# EAGLE design Mosfet+2Hbridge (EAGLE 9.3.0)
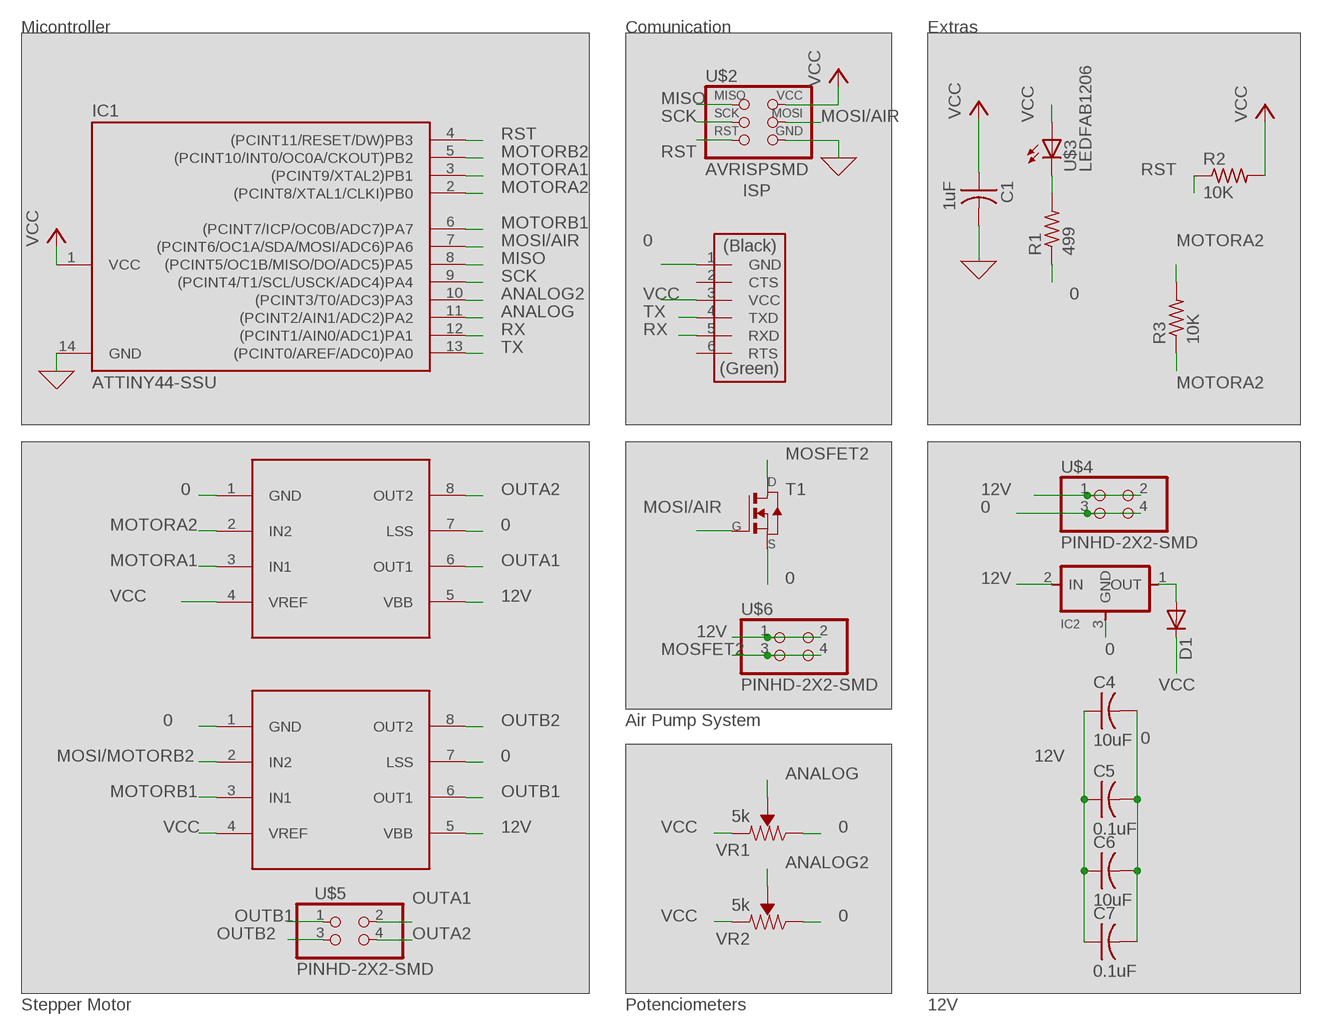
[diagram p0: schematic, sheet 1]

## Parts
C1  1uF  CAP-US1206FAB  [C1206FAB]
C4  10uF  CAP-US1206FAB  [C1206FAB]
C5  0.1uF  CAP-US1206FAB  [C1206FAB]
C6  10uF  CAP-US1206FAB  [C1206FAB]
C7  0.1uF  CAP-US1206FAB  [C1206FAB]
D1  DIODESOD123  [SOD123]
IC1  ATTINY44-SSU  [SOIC14]
IC2  REGULATORSOT23  [SOT23]
R1  499  RES-US1206FAB  [R1206FAB]
R2  10K  RES-US1206FAB  [R1206FAB]
R3  10K  RES-US1206FAB  [R1206FAB]
T1  NMOSFETTO252  [TO252]
U$1  FTDI-SMD-HEADER  [1X06SMD]
U$2  AVRISPSMD  [2X03SMD]
U$3  LEDFAB1206  [LED1206FAB]
U$4  PINHD-2X2-SMD  [2X02SMD]
U$5  PINHD-2X2-SMD  [2X02SMD]
U$6  PINHD-2X2-SMD  [2X02SMD]
U$7  A4953-H-BRIDGE-MOTOR-DRIVER  [SOIC8]
U$8  A4953-H-BRIDGE-MOTOR-DRIVER  [SOIC8]
VR1  5k  TRIMPOT-SMD-5MM-CLOSED-1/4W-20%  [TRIMPOT-SMD-5MM]
VR2  5k  TRIMPOT-SMD-5MM-CLOSED-1/4W-20%  [TRIMPOT-SMD-5MM]

## Nets
0: C1.2 C4.2 C5.2 C6.2 C7.2 IC1.14(GND) IC2.3(GND) R1.1 T1.2(S) U$1.1(GND) U$2.6(GND) U$4.3 U$4.4 U$7.1(GND) U$7.7(LSS) U$8.1(GND) U$8.7(LSS) VR1.C(CW) VR2.C(CW) ; supply symbol labelled GND
12V: C4.1 C5.1 C6.1 C7.1 IC2.2(IN) U$4.1 U$4.2 U$6.1 U$6.2 U$7.5(VBB) U$8.5(VBB)
ANALOG: IC1.11((PCINT2/AIN1/ADC2)PA2) VR1.B(WIPER)
ANALOG2: IC1.10((PCINT3/T0/ADC3)PA3) VR2.B(WIPER)
MISO: IC1.8((PCINT5/OC1B/MISO/DO/ADC5)PA5) U$2.1(MISO)
MOSFET2: T1.3(D) U$6.3 U$6.4
MOSI/AIR: IC1.7((PCINT6/OC1A/SDA/MOSI/ADC6)PA6) T1.1(G) U$2.4(MOSI)
MOSI/MOTORB2: U$7.2(IN2)
MOTORA1: IC1.3((PCINT9/XTAL2)PB1) U$8.3(IN1)
MOTORA2: IC1.2((PCINT8/XTAL1/CLKI)PB0) R3.1 R3.2 U$8.2(IN2)
MOTORB1: IC1.6((PCINT7/ICP/OC0B/ADC7)PA7) U$7.3(IN1)
MOTORB2: IC1.5((PCINT10/INT0/OC0A/CKOUT)PB2)
N$1: R1.2 U$3.2(C)
N$11: D1.ANODE(A) IC2.1(OUT)
OUTA1: U$5.2 U$8.6(OUT1)
OUTA2: U$5.4 U$8.8(OUT2)
OUTB1: U$5.1 U$7.6(OUT1)
OUTB2: U$5.3 U$7.8(OUT2)
RST: IC1.4((PCINT11/RESET/DW)PB3) R2.1 U$2.5(RST)
RX: IC1.12((PCINT1/AIN0/ADC1)PA1) U$1.5(RXD)
SCK: IC1.9((PCINT4/T1/SCL/USCK/ADC4)PA4) U$2.3(SCK)
TX: IC1.13((PCINT0/AREF/ADC0)PA0) U$1.4(TXD)
VCC: C1.1 D1.CATHODE(C) IC1.1(VCC) R2.2 U$1.3(VCC) U$2.2(VCC) U$3.1(A) U$7.4(VREF) U$8.4(VREF) VR1.A(CCW) VR2.A(CCW)
Unconnected: U$1.2(CTS) U$1.6(RTS)

## Notes on the sheet
- Micontroller | Comunication | Extras
- ISP
- Air Pump System
- Stepper Motor | Potenciometers | 12V

## Library data of the parts
C1 C4-C7 = fab:CAP-US
D1 = fab:DIODE: DIODE high speed (Philips)
IC1 = fab:ATTINY44
IC2 = fab:REGULATOR
R1-R3 = fab:RES-US: Resistor (US Symbol) Variants with postfix FAB are widened to allow the routing of internal traces
T1 = fab:NMOSFET: MOS FET
U$1 = fab:FTDI-SMD-HEADER
U$2 = fab:AVRISP
U$3 = fab:LED: LED
U$4-U$6 = fab:PINHD-2X2-SMD
U$7 U$8 = fab:A4953-H-BRIDGE-MOTOR-DRIVER
VR1 VR2 = SparkFun-Resistors:TRIMPOT: Trimming Potentiometer (Trimpot) Three-terminal potentiometers, with an adjustable wiper and two adjustable resistors. A pot can be used to create a configurable voltage divider, or as a variable resistor. "Trimpots" are a subset of potentiometers, usually intended for "set-and-forget" applications. They're often more delicate than standard potentiometers - rated for fewer turns. Variants PTH-KNOB - PTH Trimpot w/ finger-adjustable knob Trimpot 10K with Knob <https://www.sparkfun.com/products/9806> (COM-09806) Datasheet <http://www.sparkfun.com/datasheets/Components/General/TSR-3386.pdf> SMD-3MM-CLOSED-FRAME - SMD 3mm Square Closed-Frame Trimpot Used on e.g. EasyDriver - Stepper Motor Driver <https://www.sparkfun.com/products/12779> Datasheet <http://www.bitechnologies.com/pdfs/22.pdf> (22AR10KTR) SMD-5MM - SMD 5mm Square Closed-Frame Trimpot Used on e.g. IOIO-OTG - V2.2 <https://www.sparkfun.com/products/13613> Datasheet <http://www.vishay.com/docs/51008/ts53.pdf> (TS53YL502MR10) SMD-3MM-1/10W-25% - 3mm Square Open-Frame Trimpot Used on e.g. SparkFun Shapeoko <https://www.sparkfun.com/products/13899> Datasheet <http://www.bourns.com/docs/Product-Datasheets/TC33.pdf> (TC33X-2-103E); PROD_ID: RES-11156

## Board
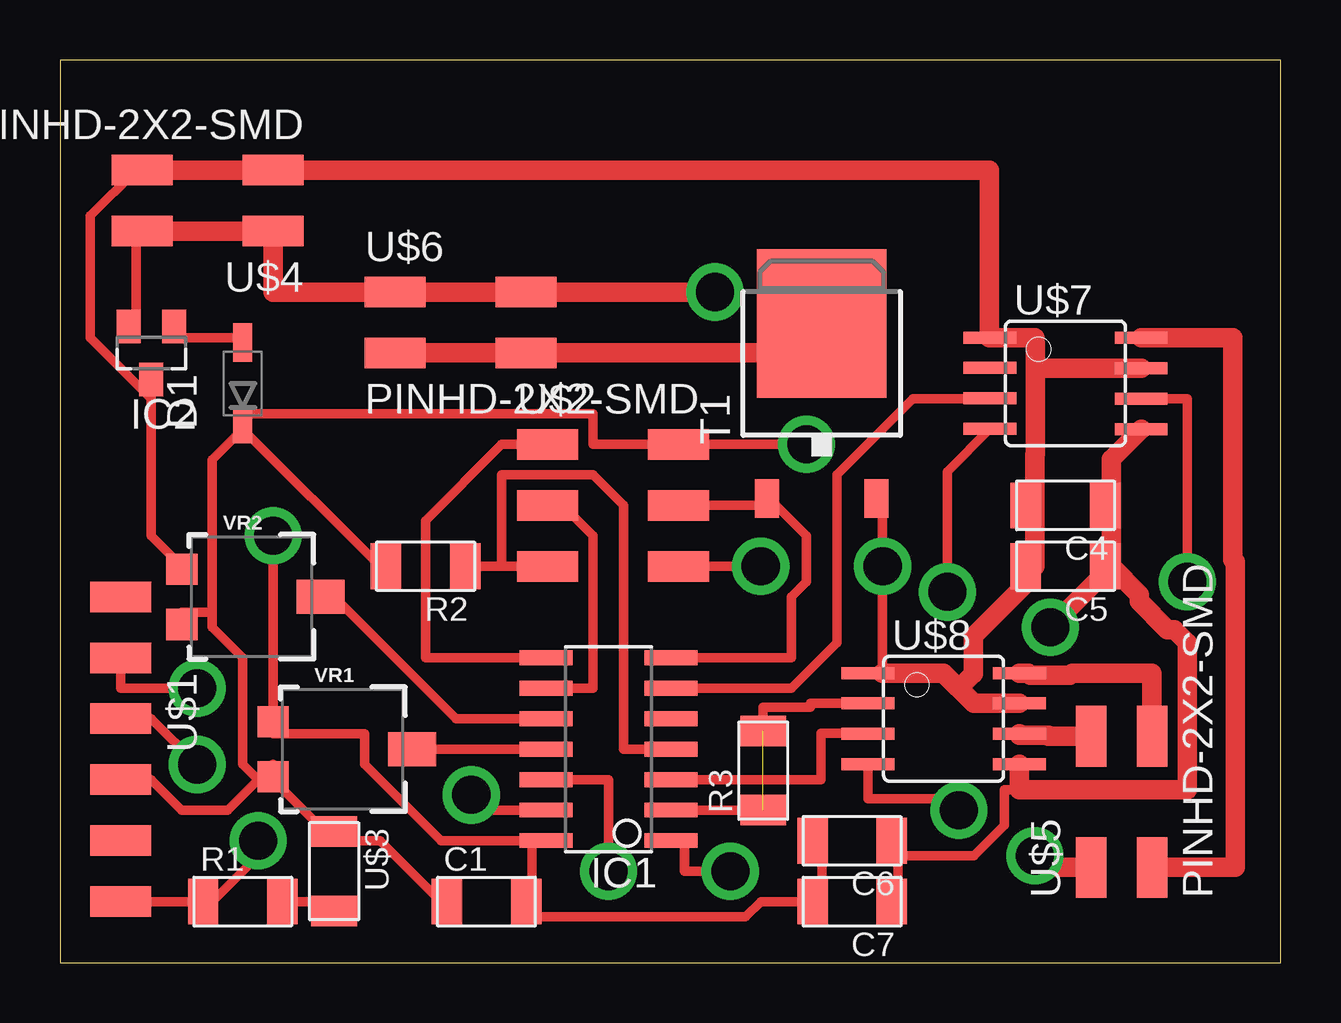
[diagram p1: board, top side]
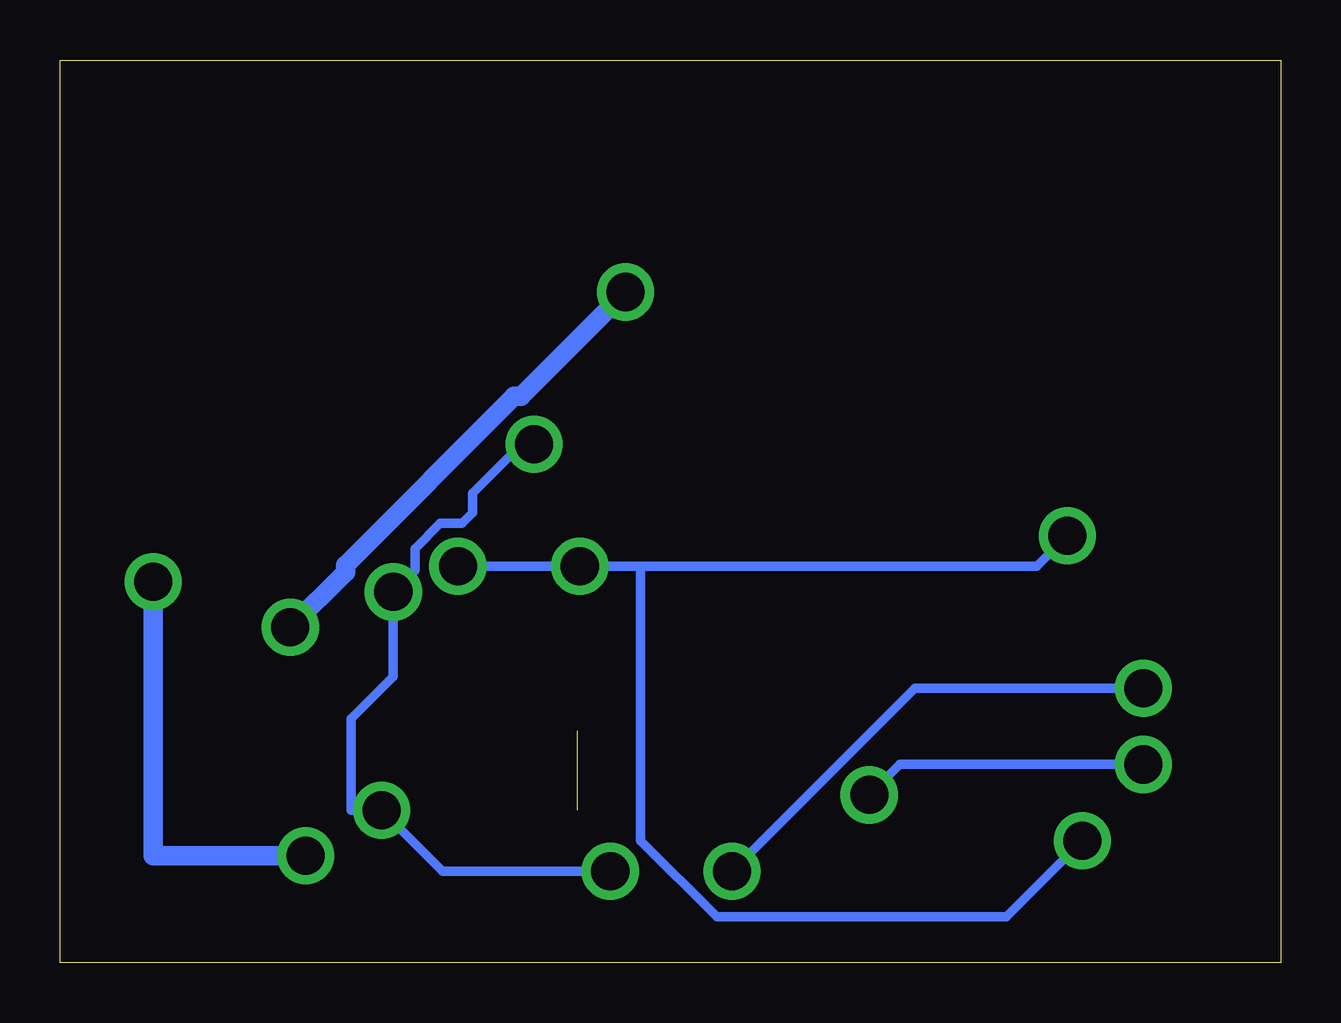
[diagram p2: board, bottom side, seen from below]

Size 50.88 x 37.61 mm. Coordinates in mm from the lower left corner, seen from the top.
Outline: 0,0 50.88,0 50.88,37.61 0,37.61 0,0
Copper layers (1*16): Top 0.035mm / dielectric 1.5mm / Bottom 0.035mm
Design rules "default *": minimum track width 0.4mm, minimum drill 62.5mil, track to track 0.4mm, track to pad 0.4mm, pad to pad 0.4mm, via to via 0.4mm, smd to smd 0.4mm, copper to edge 40mil, drill to drill 0.4mm, minimum pad ring 10mil, minimum via ring 8mil, stop-mask expansion 4mil, vias tented up to drill 0mil, thermal gap 10mil

### Footprints (pad centres in the part's own frame; a part is rotated, then mirrored left to right if it is on the bottom)
C1206FAB = smd 1.27 x 1.905: 1 -1.651,0; 2 1.651,0
SOD123 = smd 1.6 x 0.8: ANODE 1.7,0; CATHODE -1.7,0
SOIC14 = smd 0.61 x 2.21: 1 -3.81,-2.603; 2 -2.54,-2.603; 3 -1.27,-2.603; 4 0,-2.603; 5 1.27,-2.603; 6 2.54,-2.603; 7 3.81,-2.603; 8 3.81,2.603; 9 2.54,2.603; 10 1.27,2.603; 11 0,2.603; 12 -1.27,2.603; 13 -2.54,2.603; 14 -3.81,2.603
SOT23 = smd 1 x 1.4: 1 -0.95,-1.1; 2 0.95,-1.1; 3 0,1.1
R1206FAB = smd 1.27 x 1.905: 1 -1.651,0; 2 1.651,0
TO252 = smd 1 x 1.6: 1 -2.28,-4.8; 2 2.28,-4.8 | smd 5.4 x 6.2: 3 0,2.5
1X06SMD = smd 2.54 x 1.27: 1 0,6.35; 2 0,3.81; 3 0,1.27; 4 0,-1.27; 5 0,-3.81; 6 0,-6.35
2X03SMD = smd 2.54 x 1.27: 1 -2.54,2.54; 2 2.92,2.54; 3 -2.54,0; 4 2.92,0; 5 -2.54,-2.54; 6 2.92,-2.54
LED1206FAB = smd 1.27 x 1.905: 1 -1.651,0; 2 1.651,0
2X02SMD = smd 2.54 x 1.27: 1 -2.54,1.27; 2 2.92,1.27; 3 -2.54,-1.27; 4 2.92,-1.27
SOIC8 = smd 0.5 x 2.2: 1 -1.905,-3.154; 2 -0.645,-3.154; 3 0.625,-3.154; 4 1.895,-3.154; 5 1.905,3.154; 6 0.635,3.154; 7 -0.635,3.154; 8 -1.905,3.154
TRIMPOT-SMD-5MM = smd 1.3 x 1.3: A 1.15,-2.54; C -1.15,-2.54 | smd 1.402 x 2: B 0,3.239

### Placement (x,y rotation side)
C1  17.78,2.54 0 top
C4  41.91,19.05 180 top
C5  41.91,16.51 180 top
C6  33.02,5.08 180 top
C7  33.02,2.54 180 top
D1  7.62,24.13 90 top
IC1  22.86,8.89 90 top
IC2  3.81,25.4 180 top
R1  7.62,2.54 0 top
R2  15.24,16.51 180 top
R3  29.31,8 90 top
T1  31.75,24.13 0 top
U$1  2.54,8.89 180 top
U$2  22.86,19.05 0 top
U$3  11.43,3.81 270 top
U$4  6.35,31.75 180 top
U$5  44.25,6.5 90 top
U$6  16.51,26.67 0 top
U$7  41.91,24.13 270 top
U$8  36.83,10.16 270 top
VR1  11.43,8.89 270 top
VR2  7.62,15.24 270 top

### Tracks (layer width: path | path; a pad name or v marks a point on that pad's centre or on a via)
0  (via drill 1.59)
  Top 0.4: C6.2 31.75,5.08 31.75,2.54 C7.2 29.21,2.54 28.57,1.91 19.68,1.91 19.68,2.54 | 19.68,5.08 15.88,5.08 12.7,8.26 12.7,9.53 8.89,9.53 VR1.C v8.89,17.78 | 19.68,5.08 19.68,2.54 | 19.68,5.08 IC1.14 | 19.68,2.54 C1.2 | IC2.3 3.81,23.5 | 3.81,23.5 3.81,17.78 5.08,16.51 VR2.C | 3.81,23.5 1.27,26.04 1.27,31.11 3.17,33.02 U$4.4 | 40.64,19.05 40.64,26.04 | U$1.1 R1.1 6.35,2.54 8.26,4.45 v8.26,5.08 | T1.2 34.29,19.05 v34.29,16.51 34.29,12.06 U$8.1 | 38.1,10.79 37.47,11.43 | v29.21,16.51 U$2.6 | 38.73,26.04 U$7.1
  Top 0.813: U$4.4 U$4.3 38.73,33.02 38.73,26.04 | U$7.7 40.66,24.77 | 40.66,24.77 40.66,25.83 40.64,25.83 40.64,26.04 U$7.1 | C4.2 40.64,19.05 | 40.64,19.05 40.64,21.18 40.66,21.18 40.66,24.77 | 40.64,19.05 40.64,16.51 C5.2 40.26,15.78 38.08,13.6 38.08,12.04 37.47,11.43 | U$8.7 38.1,10.79 36.83,12.06 34.29,12.06
  Bottom 0.4: v34.29,16.51 v29.21,16.51 26.67,16.51 | v8.26,5.08 11.43,1.91 23.5,1.91 26.67,5.08 26.67,16.51 | v8.89,17.78 10.16,16.51 26.67,16.51
12V  (via drill 1.59)
  Top 0.4: U$6.1 U$6.2 v27.3,27.94 | IC2.2 3.17,26.67 3.17,30.48 U$4.2 | C4.1 43.81,19.05 43.81,16.51 46.99,13.34 | 34.92,4.45 34.92,5.08 C6.1 34.92,4.45 | 34.92,4.45 34.92,2.54 C7.1 | 34.92,4.45 38.1,4.45 39.37,5.71 39.37,7.19 39.98,7.19 | v41.27,13.97 43.18,15.88 43.18,16.51 C5.1
  Top 0.813: U$8.5 39.98,7.19 46.99,7.19 46.99,13.34 46.45,13.88 46.16,13.88 44.99,15.05 44.99,15.33 43.81,16.51 | 43.81,16.51 C5.1 43.81,16.76 43.81,19.05 43.81,20.98 U$7.5 | v41.27,13.97 43.81,16.51 | v27.3,27.94 U$6.1 8.89,27.94 U$4.1 U$4.2
  Bottom 0.4: 27.41,27.84 v27.3,27.94
  Bottom 0.813: v41.27,13.97 38.98,16.27 38.98,16.55 31.94,23.59 31.66,23.59 27.41,27.84
ANALOG
  Top 0.4: IC1.11 VR1.B
ANALOG2
  Top 0.4: IC1.10 16.51,10.16 11.43,15.24 VR2.B
MISO
  Top 0.4: IC1.8 15.24,12.7 15.24,18.41 18.41,21.59 U$2.1
MOSFET2
  Top 0.4: U$6.3 U$6.4 30.48,25.4 31.75,25.4 T1.3
  Top 0.813: U$6.3 30.48,25.4
MOSI/AIR
  Top 0.4: U$2.4 29.21,19.05 T1.1 29.84,19.05 31.11,17.78 31.11,15.88 30.48,15.24 30.48,12.7 IC1.7
MOTORA1
  Top 0.4: U$8.3 33.66,9.53 33.66,9.55 31.73,9.55 31.73,7.62 IC1.3
MOTORA2  (1 unrouted)
  Top 0.4: 34.29,10.79 U$8.2 31.28,10.8 31.28,10.63 29.31,10.63 R3.2 | IC1.2 R3.1
MOTORB1
  Top 0.4: IC1.6 30.48,11.43 32.38,13.34 32.38,20.32 35.56,23.5 38.73,23.5 U$7.3
N$1
  Top 0.4: R1.2 11.43,2.54 U$3.2
N$11
  Top 0.4: IC2.1 5.08,26.04 7.62,26.04 D1.ANODE
OUTA1
  Top 0.813: U$8.6 39.98,9.47 41.2,9.47 41.2,9.42 U$5.2
OUTA2
  Top 0.813: U$8.8 40.36,12.06 40.45,11.97 42.1,11.97 42.19,12.06 45.52,12.06 U$5.4
OUTB1  (via drill 1.59)
  Top 0.4: U$7.6 46.99,23.5 v46.99,15.88
  Top 0.813: U$5.1 41.12,3.96 v40.64,4.45
  Bottom 0.813: v40.64,4.45 46.99,4.45 v46.99,15.88
OUTB2
  Top 0.813: U$7.8 48.9,26.04 48.9,16.79 48.99,16.7 48.99,3.96 U$5.3
RST
  Top 0.4: U$2.5 18.41,16.51 | 18.41,16.51 R2.1 | IC1.4 23.5,8.89 23.5,19.05 22.23,20.32 18.41,20.32 18.41,16.51
RX  (via drill 1.59)
  Top 0.4: IC1.12 22.86,7.62 v22.86,3.81 | v5.71,11.43 2.54,11.43 U$1.5
  Bottom 0.4: v22.86,3.81 15.24,11.43 v5.71,11.43
SCK
  Top 0.4: IC1.9 22.23,11.43 22.23,17.78 20.95,19.05 U$2.3
TX  (via drill 1.59)
  Top 0.4: IC1.13 17.14,6.35 v17.14,6.99 | v5.71,8.26 3.81,10.16 U$1.4
  Bottom 0.4: v17.14,6.99 15.88,8.26 v5.71,8.26
VCC  (via drill 1.59)
  Top 0.4: v27.94,3.81 26.04,3.81 26.04,5.08 IC1.1 | 11.43,5.08 8.89,7.62 VR1.A | 11.43,5.08 13.34,5.08 15.88,2.54 C1.1 | 11.43,5.08 U$3.1 | U$1.3 3.81,7.62 5.08,6.35 6.99,6.35 8.26,7.62 | 8.26,7.62 8.89,8.26 VR1.A | 6.35,14.61 5.08,14.61 VR2.A | 6.35,14.61 6.35,20.95 7.62,22.23 | 7.62,22.23 13.34,16.51 R2.2 | 7.62,22.23 D1.CATHODE 7.62,22.86 22.23,22.86 22.23,21.59 U$2.2 v31.11,21.59 | 8.26,7.62 7.62,8.26 7.62,12.7 6.35,13.97 6.35,14.61 | 8.26,7.62 VR1.A | U$7.4 36.98,20.46 v36.98,15.44 | U$8.4 33.68,6.83 37.47,6.83 v37.47,6.35
  Bottom 0.4: v27.94,3.81 34.92,3.81 v37.47,6.35 38.73,6.35 38.73,10.16 36.98,11.91 v36.98,15.44 36.08,16.34 36.08,17.25 35.03,18.3 34.12,18.3 33.68,18.75 33.68,19.56 31.75,21.49 31.75,21.59 v31.11,21.59